# Altium schematic sheet BDCMC_Top_Level.SchDoc
size B; SheetNumber: 1; SheetTotal: 5
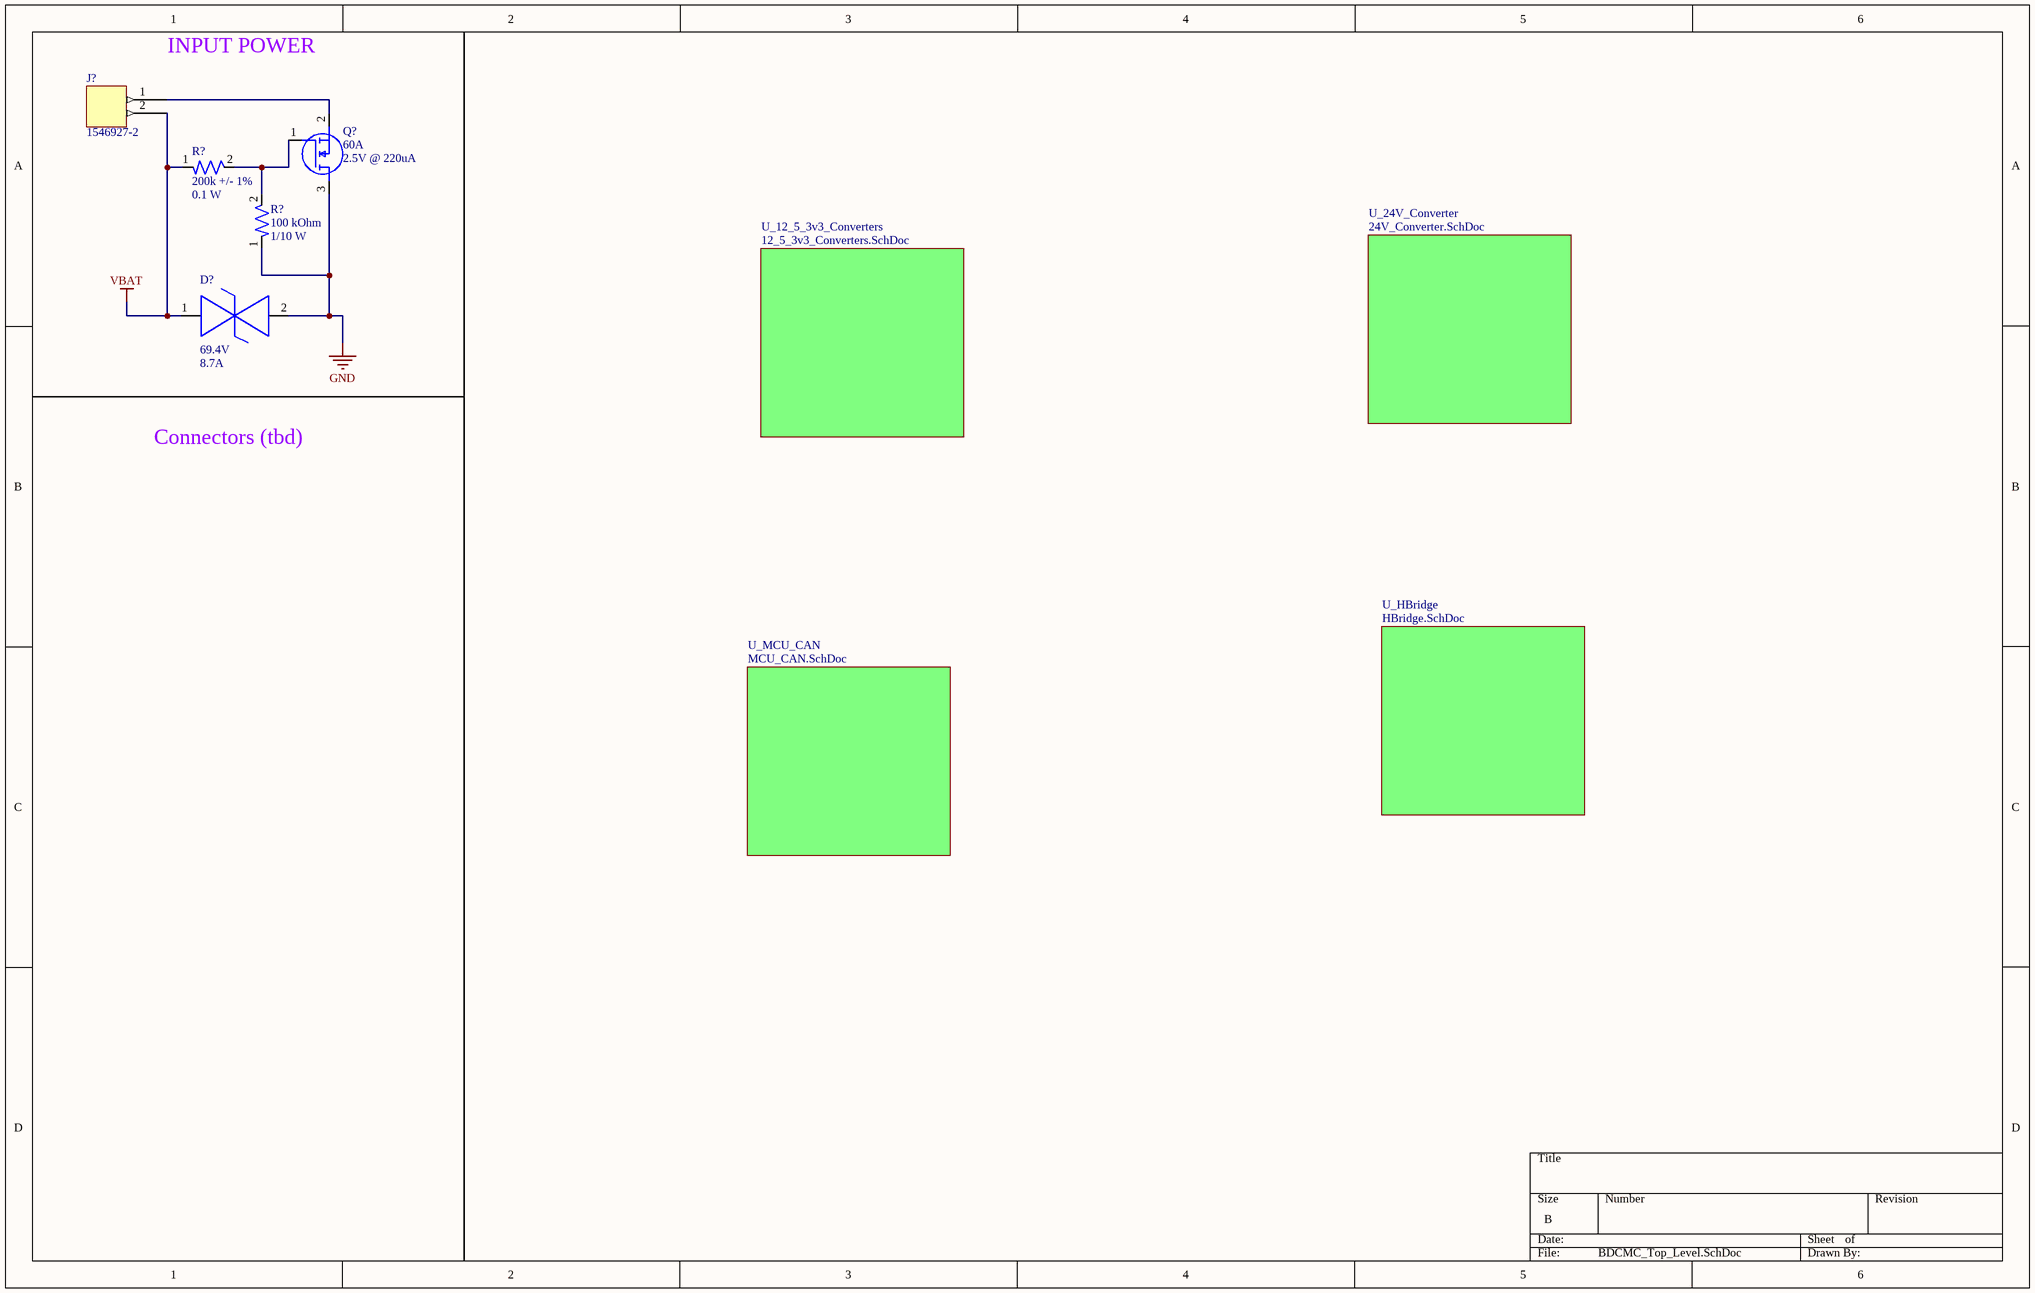
[diagram p0: BDCMC_Top_Level.SchDoc]

## Parts
(Parts that share a designator on the sheet are numbered #1, #2 ... from top to bottom, then left to right.)
D?  Vclamp: 69.4V  Peak pulser current: 8.7A  [DO-214AA (SMBJ)]  (hidden comment: SMBJE43CAH)
J?  1546927-2  [CONN-1546927-2]
Q?  Drain Current: 60A  Vgs: 2.5V @ 220uA  [NMOS-8PowerVDFN]  (hidden comment: TPH7R006PL,L1Q)
R?#1  Resistance: 200k +/- 1%  Power Rating: 0.1 W  [RES-0603]  (hidden comment: ERJ-3EKF2003V)
R?#2  Resistance: 100 kOhm  Power: 1/10 W  [RES-0603]  (hidden comment: RC0603FR-07100KL)

## Sub-sheets
U_12_5_3v3_Converters = 12_5_3v3_Converters.SchDoc: no entries
U_24V_Converter = 24V_Converter.SchDoc: no entries
U_HBridge = HBridge.SchDoc: no entries
U_MCU_CAN = MCU_CAN.SchDoc: no entries

## Nets
GND: D?.2 Q?.3(D) R?#2.1
VBAT: D?.1 J?.2 R?#1.1
NetJ?_1: J?.1 Q?.2(S)
NetQ?_1: Q?.1(G) R?#1.2 R?#2.2

## Notes on the sheet
- INPUT POWER
- Connectors (tbd)

## Library data of the parts
D? = DIO-69.4V-0001: 69.4V Clamp 8.7A Ipp Tvs Diode Surface Mount DO-214AA (SMBJ); Channels: Bidirectional; Breakdown VOltage: 47.8V; Reverse working maximum voltage: 43V; Package: DO-214AA (SMBJ)
J? = CON-2POS-0003
Q? = NMOS-60A-0001: N-Channel 60 V 60A (Tc) 81W (Tc) Surface Mount 8-SOP Advance (5x5); Vdss: 60V; Vgs(Max): 20V; Package: 8-PowerVDFN
R?#1 = RES-200K-0001: 200 kOhms ±1% 0.1W, 1/10W Chip Resistor 0603 (1608 Metric) Automotive AEC-Q200 Thick Film; Manufacturer: Panasonic Electronic Components; Assembled?: Yes; MFP: ERJ-3EKF2003V; Package SIze: 0603
R?#2 = RES-100K-0003: 100 kOhms ±1% 0.1W, 1/10W Chip Resistor 0603 (1608 Metric) Moisture Resistant Thick Film; Tolerance: +/- 1%; Assembled?: No; Package Size: 0603